# Altium schematic sheet Motor_Kontrol.SchDoc
size A4; SheetNumber: 4; SheetTotal: 5
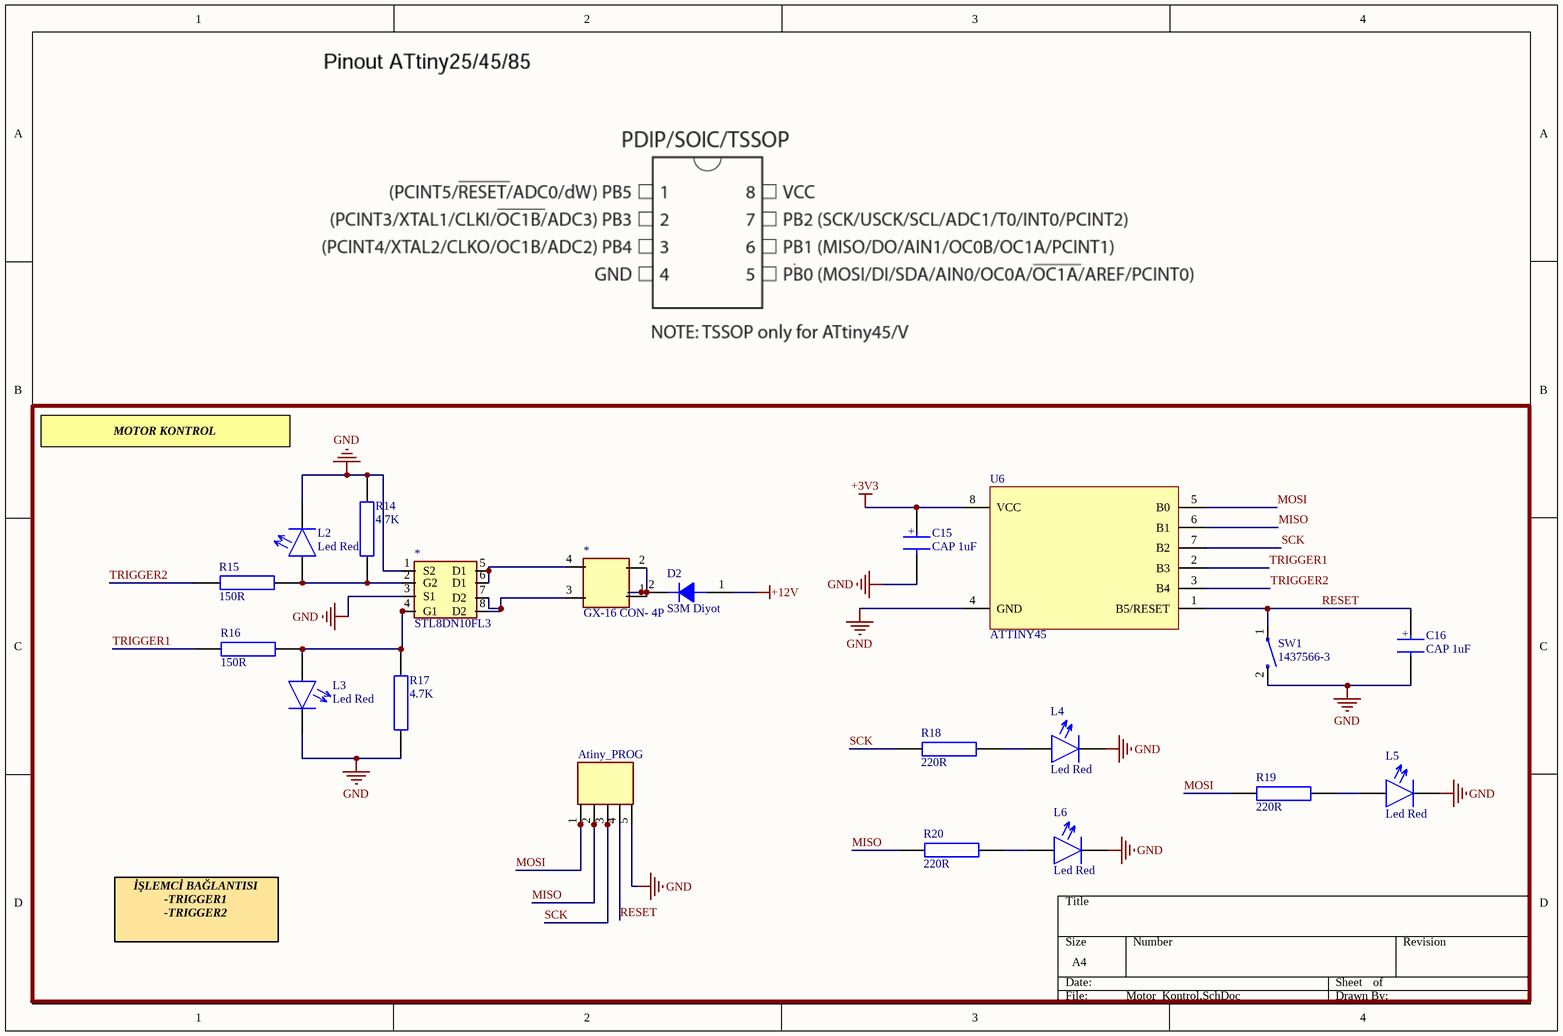
[diagram p0: Motor_Kontrol.SchDoc]

## Parts
(Parts that share a designator on the sheet are numbered #1, #2 ... from top to bottom, then left to right.)
*#1  GX-16 CON- 4P  [GX-16 CON]
*#2  STL8DN10FL3  [TRANS_STL60P4LLF6]
Atiny_PROG  SMD JST 5P  (value not drawn)
C15  CAP 1uF  [CAP_805]
C16  CAP 1uF  [CAP_805]
D2  S3M Diyot  [DO214AA]
L2  Led Red  [Led 1206]
L3  Led Red  [Led 1206]
L4  Led Red  [Led 1206]
L5  Led Red  [Led 1206]
L6  Led Red  [Led 1206]
R14  4.7K  [RES_1206]
R15  150R  [RES_1206]
R16  150R  [RES_1206]
R17  4.7K  [RES_1206]
R18  220R  [RES_1206]
R19  220R  [RES_1206]
R20  220R  [RES_1206]
SW1  1437566-3  [SW_1437566-3]
U6  ATTINY45  [soic-8]

## Nets
+3V3: C15.1 U6.8(VCC)
+12V: D2.1
GND: *#2.1(S2) *#2.3(S1) Atiny_PROG.5 C15.2 C16.2 L2.2 L3.2 L4.2 L5.2 L6.2 R14.2 R17.1 SW1.2 U6.4(GND)
MISO: Atiny_PROG.2 R20.2 U6.6(B1)
MOSI: Atiny_PROG.1 R19.2 U6.5(B0)
RESET: Atiny_PROG.4 C16.1 SW1.1 U6.1(B5/RESET)
SCK: Atiny_PROG.3 R18.2 U6.7(B2)
TRIGGER1: R16.1 U6.2(B3)
TRIGGER2: R15.1 U6.3(B4)
Net*#1_1: *#1.1 *#1.2 D2.2
Net*#1_3: *#1.3 *#2.7(D2) *#2.8(D2)
Net*#1_4: *#1.4 *#2.5(D1) *#2.6(D1)
Net*#2_2: *#2.2(G2) L2.1 R14.1 R15.2
Net*#2_4: *#2.4(G1) L3.1 R16.2 R17.2
NetL4_1: L4.1 R18.1
NetL5_1: L5.1 R19.1
NetL6_1: L6.1 R20.1

## Notes on the sheet
- MOTOR KONTROL
- İŞLEMCİ BAĞLANTISI
  -TRIGGER1
  -TRIGGER2
- (in symbol CAP 1uF) +

## Library data of the parts
C15 C16 = CAP 1uF: 0805 smd
D2 = S3M Diyot: Current: 3A; Voltage: 1000V; Case/Package: DO214AA
R14-R20 = RES 1K 1206
SW1 = 1437566-3: Switch Tactile OFF (ON) SPST Rectangular Button Gull Wing 0.05A 12VDC SMD Loose Piece; Price: None; Value: *; Package: None; Availability: Unavailable; MP: 1437566-3
U6 = ATTINY45: ATtiny Series 4 KB Flash 256 B SRAM 20 MHz 8-Bit Microcontroller - SOIC-8; Manufacturer: Microchip / Atmel; Manufacturer Part Number: ATTINY45-20SU; Frequency: 20MHz; Oscillator Type: Internal; Memory Size: 4KB; Peripherals: Brown-out Detect/Reset,POR,PWM,WDT; Number of I/Os: 6; Core Architecture: AVR; Max Supply Voltage: 5.5V; Min Supply Voltage: 2.7V; Data Bus Width: 8b; RAM Size: 256B; Watchdog Timer: Yes; Number of Timers/Counters: 2; Interface: SPI; Number of ADC Channels: 4; Number of SPI Channels: 1; Access Time: 20us; Supplier 1: Newark; RoHS: Yes; Category: Microcontrollers; Mount: Surface Mount; Case/Package: SOIC; Number of Pins: 8; Contact Plating: Tin,Matte; Min Operating Temperature: -40°C; Max Operating Temperature: 85°C; Memory Type: FLASH; Packaging: Rail/Tube; Package Quantity: 95; Max Frequency: 20MHz; Number of Programmable I/O: 6; Number of PWM Channels: 6; Number of I2C Channels: 1; Number of UART Channels: 1; Termination: SMD/SMT; Address Bus Width: 8b; Length: 5.35mm; Width: 5.4mm; Height: 1.91mm; Radiation Hardening: No; Lead Free: Lead Free; REACH SVHC: No SVHC; ComponentLink1URL: https://datasheet.ciiva.com/15122/getdatasheetpartid-123040-15122445.pdf?src-supplier=Verical; ComponentLink1Description: https://datasheet.ciiva.com/15122/getdatasheetpartid-123040-15122445.pdf?src-supplier=Verical; ComponentLink2URL: https://datasheet.ciiva.com/28653/1738893-28653749.pdf?src-supplier=Element14; ComponentLink2Description: https://datasheet.ciiva.com/28653/1738893-28653749.pdf?src-supplier=Element14; ComponentLink3URL: https://datasheet.ciiva.com/3203/doc2586-3203982.pdf?src-supplier=Avnet; ComponentLink3Description: https://datasheet.ciiva.com/3203/doc2586-3203982.pdf?src-supplier=Avnet; ComponentLink4URL: https://datasheet.ciiva.com/26207/doc2586-26207534.pdf?src-supplier=Avnet+Europe; ComponentLink4Description: https://datasheet.ciiva.com/26207/doc2586-26207534.pdf?src-supplier=Avnet+Europe; Supplier Part Number 1: 68T3731